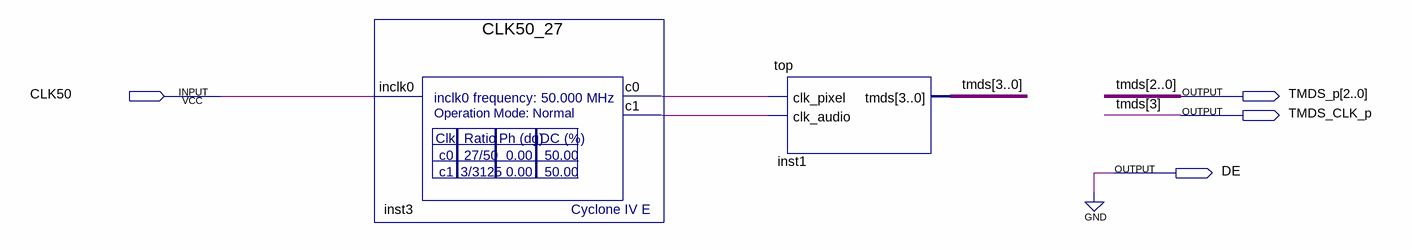
[diagram p0: schematic sheet]
// Quartus schematic HDMI_test.bdf as structural Verilog: 2 symbols, 4 pins
module HDMI_test (
  input  CLK50,
  output [2:0] TMDS_p,
  output TMDS_CLK_p,
  output DE
);

  wire inst3_c0, inst3_c1;

  CLK50_27 inst3 (.inclk0(CLK50), .c0(inst3_c0), .c1(inst3_c1));
  top inst1 (.clk_pixel(inst3_c0), .clk_audio(inst3_c1), .tmds({TMDS_CLK_p, TMDS_p}));

  assign DE = 1'b0;

  // Other names for the same wires on the sheet: tmds[3:0] = {TMDS_CLK_p, TMDS_p}
endmodule
